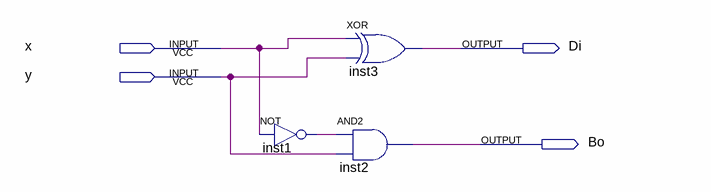
[diagram p0: schematic sheet]
// Quartus schematic halfSub.bdf as structural Verilog: 3 symbols, 4 pins
module halfSub (
  input  x,
  input  y,
  output Di,
  output Bo
);

  wire inst1_out;

  not inst1 (inst1_out, x);
  xor inst3 (Di, x, y);
  and inst2 (Bo, inst1_out, y);
endmodule
